# EAGLE design Encoder_board (EAGLE 8.0.1)
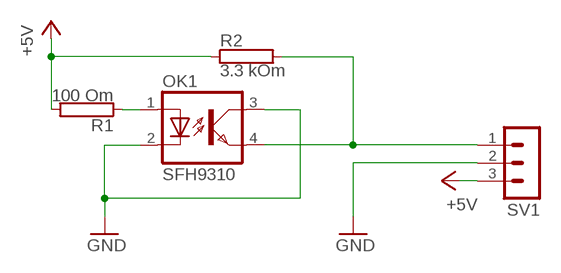
[diagram p0: schematic, sheet 1]

## Parts
OK1  SFH9310  [SFH9310]
R1  100 Om  RRS1/4  [RS1/4]
R2  3.3 kOm  RRS1/4  [RS1/4]
SV1  MA03-1  [MA03-1]

## Nets
+5V: R1.2 R2.1 SV1.3
GND: OK1.2(C) OK1.3(COL) SV1.2
N$2: OK1.1(A) R1.1
SIG: OK1.4(EMIT) R2.2 SV1.1

## Library data of the parts
OK1 = optocoupler:SFH9*: Slotted Interrupter / Gabellichtschranke Source: http://www.osram.convergy.de/; OC_FARNELL: unknown; OC_NEWARK: unknown
R1 R2 = resistor-power:R: Power Resitor; MF: OHMITE; MPN: RRS1K0; OC_FARNELL: unknown; OC_NEWARK: 01F7661
SV1 = con-lstb:MA03-1: PIN HEADER; OC_FARNELL: unknown; OC_NEWARK: unknown

## Board
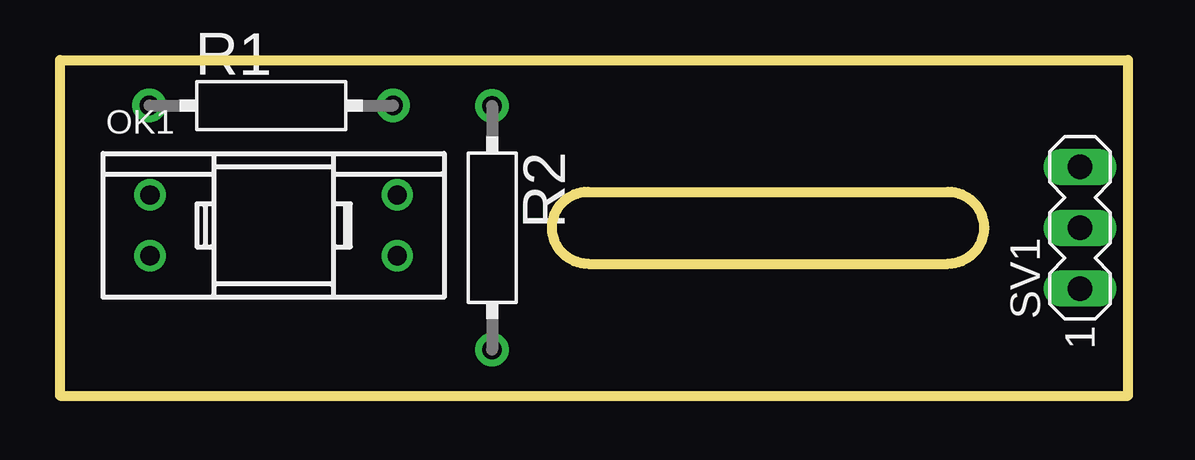
[diagram p1: board, top side]
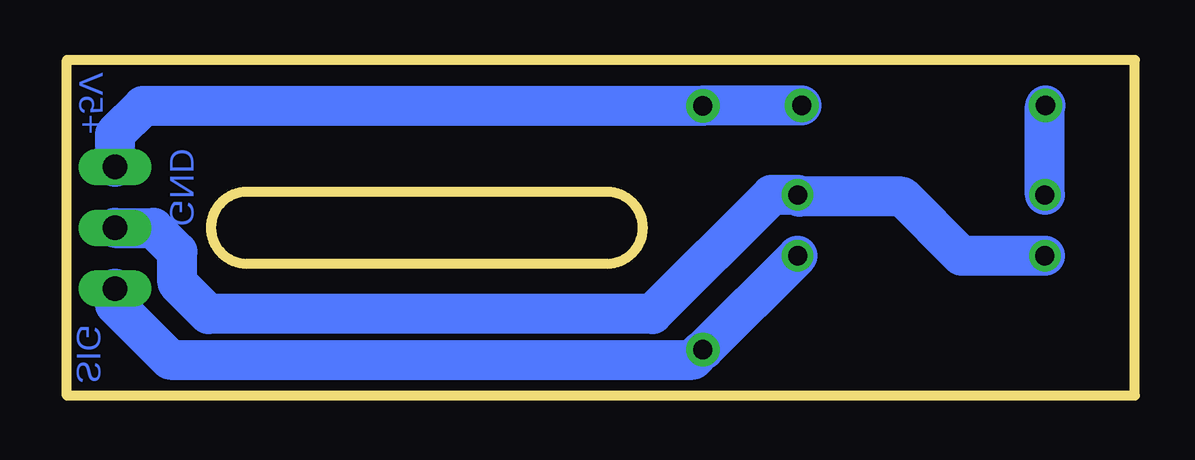
[diagram p2: board, bottom side, seen from below]

Size 44.5 x 14 mm. Coordinates in mm from the lower left corner, seen from the top.
Outline: 0,0 0,14 44.5,14 44.5,0 0,0
Outline: 37,8.5 arc-180 37,5.5 22,5.5 arc-180 22,8.5 37,8.5
Copper layers (1*16): Top 0.035mm / dielectric 1.5mm / Bottom 0.035mm
Design rules "default": minimum track width 10mil, minimum drill 24mil, track to track 8mil, track to pad 8mil, pad to pad 8mil, via to via 8mil, smd to smd 8mil, copper to edge 40mil, drill to drill 8mil, minimum pad ring 10mil, minimum via ring 8mil, stop-mask expansion 4mil, vias tented up to drill 0mil, thermal gap 10mil

### Footprints (pad centres in the part's own frame; a part is rotated, then mirrored left to right if it is on the bottom)
SFH9310 = drill 0.8: 1 -5.15,1.27; 2 -5.15,-1.27; 3 5.15,1.27; 4 5.15,-1.27
RS1/4 = drill 0.8 pad 1.4: 1 -5.08,0; 2 5.08,0
MA03-1 = drill 1.016 long: 1 -2.54,0; 2 0,0; 3 2.54,0

### Placement (x,y rotation side)
OK1  8.9,7.1 0 top
R1  8.8,12.1 0 top
R2  18,7 270 top
SV1  42.5,7 90 top

### Tracks (layer width: path | path; a pad name or v marks a point on that pad's centre or on a via)
+5V
  Bottom 1.676: R1.2 17.98,12.1 R2.1 41.32,12.08 42.5,10.9 SV1.3
GND
  Bottom 1.676: OK1.2 7.23,5.83 9.7,8.3 13.98,8.3 OK1.3 15.13,8.37 20.1,3.4 38.6,3.4 39.9,4.7 39.9,6 40.9,7 SV1.2
N$2
  Bottom 1.676: OK1.1 3.75,12.07 R1.1
SIG
  Bottom 1.676: SV1.1 42.5,3.8 40.2,1.5 18.42,1.5 R2.2 17.96,1.92 OK1.4

### Text on the board
Bottom: GND | +5V | SIG